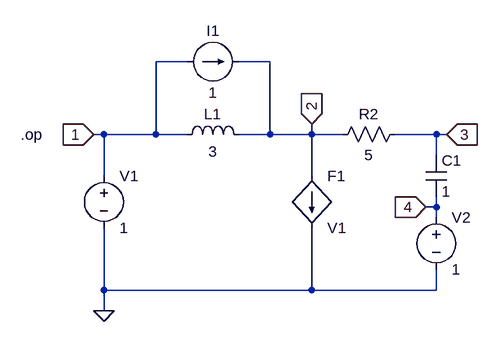
[diagram p0: schematic initial_conditions.asc]
initial_conditions.asc, the LTspice schematic file:
Version 4
SHEET 1 880 680
WIRE 32 -48 -16 -48
WIRE 160 -48 112 -48
WIRE -96 64 -112 64
WIRE -16 64 -16 -48
WIRE -16 64 -96 64
WIRE 32 64 -16 64
WIRE 160 64 160 -48
WIRE 160 64 112 64
WIRE 224 64 224 48
WIRE 224 64 160 64
WIRE 272 64 224 64
WIRE 416 64 352 64
WIRE 432 64 416 64
WIRE 416 96 416 64
WIRE -96 128 -96 64
WIRE 224 128 224 64
WIRE 416 176 416 160
WIRE 416 176 400 176
WIRE 416 192 416 176
WIRE -96 304 -96 208
WIRE 224 304 224 208
WIRE 224 304 -96 304
WIRE 416 304 416 272
WIRE 416 304 224 304
WIRE -96 336 -96 304
FLAG -96 336 0
FLAG -112 64 1
IOPIN -112 64 In
FLAG 224 48 2
IOPIN 224 48 In
FLAG 432 64 3
IOPIN 432 64 In
FLAG 400 176 4
IOPIN 400 176 In
SYMBOL voltage -96 112 R0
WINDOW 123 0 0 Left 0
WINDOW 39 0 0 Left 0
SYMATTR InstName V1
SYMATTR Value 1
SYMBOL res 368 48 R90
WINDOW 0 0 56 VBottom 2
WINDOW 3 32 56 VTop 2
SYMATTR InstName R2
SYMATTR Value 5
SYMBOL cap 400 96 R0
SYMATTR InstName C1
SYMATTR Value 1
SYMBOL voltage 416 176 R0
SYMATTR InstName V2
SYMATTR Value 1
SYMBOL ind 16 80 R270
WINDOW 0 32 56 VTop 2
WINDOW 3 5 56 VBottom 2
SYMATTR InstName L1
SYMATTR Value 3
SYMATTR SpiceLine Rser=0
SYMBOL current 32 -48 R270
WINDOW 0 32 40 VTop 2
WINDOW 3 -32 40 VBottom 2
SYMATTR InstName I1
SYMATTR Value 1
SYMBOL f 224 128 R0
SYMATTR InstName F1
SYMATTR Value V1
SYMATTR Value2 2
TEXT -224 64 Left 2 !.op

The netlist it stands for:
* initial_conditions.asc
V1 1 0 1
R2 3 2 5
C1 3 4 1
V2 4 0 1
L1 1 2 3 Rser=0
I1 1 2 1
F1 2 0 V1 2
.op
.backanno
.end